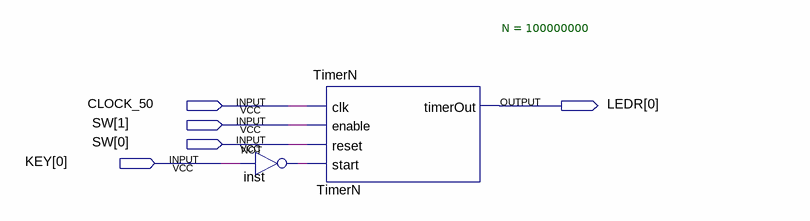
[diagram p0: schematic sheet]
// Quartus schematic TimerN_Demo.bdf as structural Verilog: 2 symbols, 5 pins
module TimerN_Demo (
  input  CLOCK_50,
  input  [1:0] SW,
  input  [0:0] KEY,
  output [0:0] LEDR
);

  wire inst_out;

  not inst (inst_out, KEY[0]);
  TimerN #(.N(100000000)) TimerN (.clk(CLOCK_50), .enable(SW[1]), .reset(SW[0]), .start(inst_out), .timerOut(LEDR[0]));
endmodule
